# Altium schematic sheet Sheet_1_2026-05-25.schdoc
size 256 x 273 mm
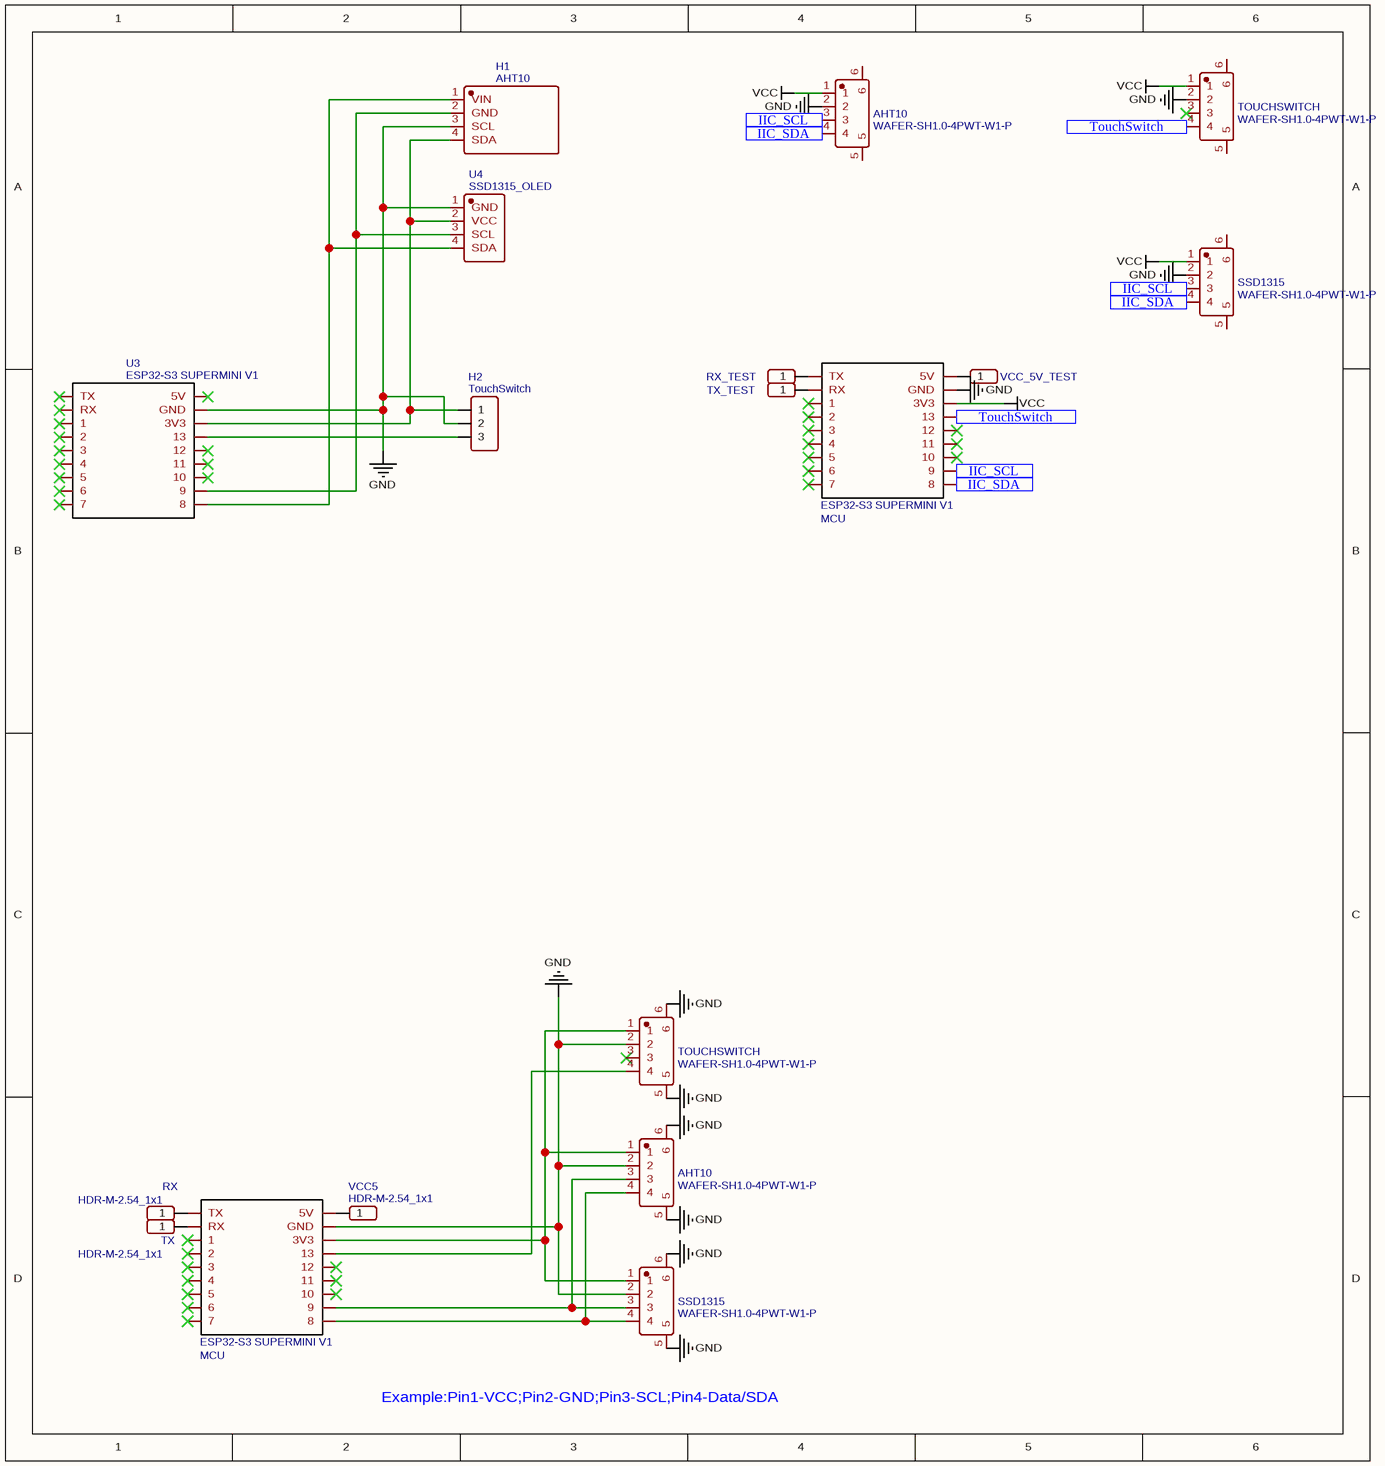
[diagram p0: Sheet_1_2026-05-25.schdoc]

## Parts
(Parts that share a designator on the sheet are numbered #1, #2 ... from top to bottom, then left to right.)
AHT10#1  WAFER-SH1.0-4PWT-W1-P  [CONN-SMD_WAFER-SH1.0-4PWT-W1-P]
AHT10#2  WAFER-SH1.0-4PWT-W1-P  [CONN-SMD_WAFER-SH1.0-4PWT-W1-P]
H1  AHT10  [AHT20]
H2  TouchSwitch  [HDR-F-2.54_1X3]
MCU#1  ESP32-S3 SUPERMINI V1  [ESP32S3-SUPERMINI-V1]
MCU#2  ESP32-S3 SUPERMINI V1  [ESP32S3-SUPERMINI-V1]
RX  HDR-M-2.54_1x1  [HDR-M-2.54_1X1]
RX_TEST  HDR-M-2.54_1x1  [HDR-M-2.54_1X1]  (value not drawn)
SSD1315#1  WAFER-SH1.0-4PWT-W1-P  [CONN-SMD_WAFER-SH1.0-4PWT-W1-P]
SSD1315#2  WAFER-SH1.0-4PWT-W1-P  [CONN-SMD_WAFER-SH1.0-4PWT-W1-P]
TOUCHSWITCH#1  WAFER-SH1.0-4PWT-W1-P  [CONN-SMD_WAFER-SH1.0-4PWT-W1-P]
TOUCHSWITCH#2  WAFER-SH1.0-4PWT-W1-P  [CONN-SMD_WAFER-SH1.0-4PWT-W1-P]
TX  HDR-M-2.54_1x1  [HDR-M-2.54_1X1]
TX_TEST  HDR-M-2.54_1x1  [HDR-M-2.54_1X1]  (value not drawn)
U3  ESP32-S3 SUPERMINI V1  [ESP32S3-SUPERMINI-V1]
U4  SSD1315_OLED  [SSD1315_OLED_PCBPPIN去掉螺丝孔]
VCC5  HDR-M-2.54_1x1  [HDR-M-2.54_1X1]
VCC_5V_TEST  HDR-M-2.54_1x1  [HDR-M-2.54_1X1]  (value not drawn)

## Ports
IIC_SCL (in), IIC_SDA (in), TouchSwitch (in)

## Nets
GND: AHT10#1.2 AHT10#2.2 AHT10#2.5 AHT10#2.6 H1.3(SCL) H2.2 MCU#1.GND MCU#2.GND SSD1315#1.2 SSD1315#2.2 SSD1315#2.5 SSD1315#2.6 TOUCHSWITCH#1.2 TOUCHSWITCH#2.2 TOUCHSWITCH#2.5 TOUCHSWITCH#2.6 U3.GND U4.1(GND)
VCC: AHT10#1.1 MCU#1.3V3 SSD1315#1.1 TOUCHSWITCH#1.1
IIC_SCL: AHT10#1.3 MCU#1.GPIO9(9) SSD1315#1.3 ; port IIC_SCL
IIC_SDA: AHT10#1.4 MCU#1.GPIO8(8) SSD1315#1.4 ; port IIC_SDA
TouchSwitch: MCU#1.GPIO13(13) TOUCHSWITCH#1.4 ; port TouchSwitch
NetAHT10#2_1: AHT10#2.1 MCU#2.3V3 SSD1315#2.1 TOUCHSWITCH#2.1
NetAHT10#2_3: AHT10#2.3 MCU#2.GPIO9(9) SSD1315#2.3
NetAHT10#2_4: AHT10#2.4 MCU#2.GPIO8(8) SSD1315#2.4
NetH1_1: H1.1(VIN) U3.GPIO8(8) U4.4(SDA)
NetH1_2: H1.2(GND) U3.GPIO9(9) U4.3(SCL)
NetH1_4: H1.4(SDA) H2.1 U3.3V3 U4.2(VCC)
NetH2_3: H2.3 U3.GPIO13(13)
NetMCU#1_5V: MCU#1.5V VCC_5V_TEST.1
NetMCU#1_RX: MCU#1.RX TX_TEST.1
NetMCU#1_TX: MCU#1.TX RX_TEST.1
NetMCU#2_5V: MCU#2.5V VCC5.1
NetMCU#2_GPIO13: MCU#2.GPIO13(13) TOUCHSWITCH#2.4
NetMCU#2_RX: MCU#2.RX TX.1
NetMCU#2_TX: MCU#2.TX RX.1

Not connected (* = marked no-connect by the designer): AHT10#1 5 6; MCU#1 GPIO1(1)* GPIO2(2)* GPIO3(3)* GPIO4(4)* GPIO5(5)* GPIO6(6)* GPIO7(7)* GPIO10(10)* GPIO11(11)* GPIO12(12)*; MCU#2 GPIO1(1)* GPIO2(2)* GPIO3(3)* GPIO4(4)* GPIO5(5)* GPIO6(6)* GPIO7(7)* GPIO10(10)* GPIO11(11)* GPIO12(12)*; SSD1315#1 5 6; TOUCHSWITCH#1 3* 5 6; TOUCHSWITCH#2 3*; U3 5V* GPIO1(1)* GPIO2(2)* GPIO3(3)* GPIO4(4)* GPIO5(5)* GPIO6(6)* GPIO7(7)* GPIO10(10)* GPIO11(11)* GPIO12(12)* RX* TX*

## Notes on the sheet
- Example:Pin1-VCC;Pin2-GND;Pin3-SCL;Pin4-Data/SDA

## Library data of the parts
AHT10#1 AHT10#2 SSD1315#1 SSD1315#2 TOUCHSWITCH#1 TOUCHSWITCH#2 = WAFER-SH1.0-4PWT-W1-P: Manufacturer: Zhongdi(众迪); Contributor: lcsc; Supplier: LCSC; Supplier Part: C22448333; Manufacturer Part: WAFER-SH1.0-4PWT-W1-P; JLCPCB Part Class: Extended Part; spicePre: C; spiceSymbolName: WAFER-SH1.0-4PWT-W1-P
H1 = AHT10: Manufacturer: XFCN(兴飞); Manufacturer Part: PZ254V-12-10P; Contributor: LCSC; Supplier: LCSC; Supplier Part: C492422; JLCPCB Part Class: Extended Part; spicePre: H; spiceSymbolName: AHT20
H2 = TouchSwitch: Contributor: LCEDA_Lib; Supplier Part: C146690; Supplier: LCSC; spicePre: H; spiceSymbolName: HDR-F-2.54_1x3
MCU#1 MCU#2 U3 = ESP32-S3 SUPERMINI V1: Contributor: c290129114; Supplier: 无名科技; spicePre: U; spiceSymbolName: ESP32-S3 SUPERMINI V1
RX RX_TEST TX TX_TEST VCC5 VCC_5V_TEST = HDR-M-2.54_1x1: Contributor: LCEDA_Lib; Supplier Part: C81276; Supplier: LCSC; spicePre: J; spiceSymbolName: HDR-M-2.54_1x1
U4 = SSD1315_OLED: Manufacturer: DEALON(德艺隆); Manufacturer Part: DM254R-11-04-85; Contributor: LCSC; Supplier: LCSC; Supplier Part: C2935975; JLCPCB Part Class: Extended Part; spicePre: U; spiceSymbolName: SSD1315_OLED_PCBPIN